# Altium schematic sheet OLED胸牌_从机_2022-05-08.schdoc
size 312 x 139 mm
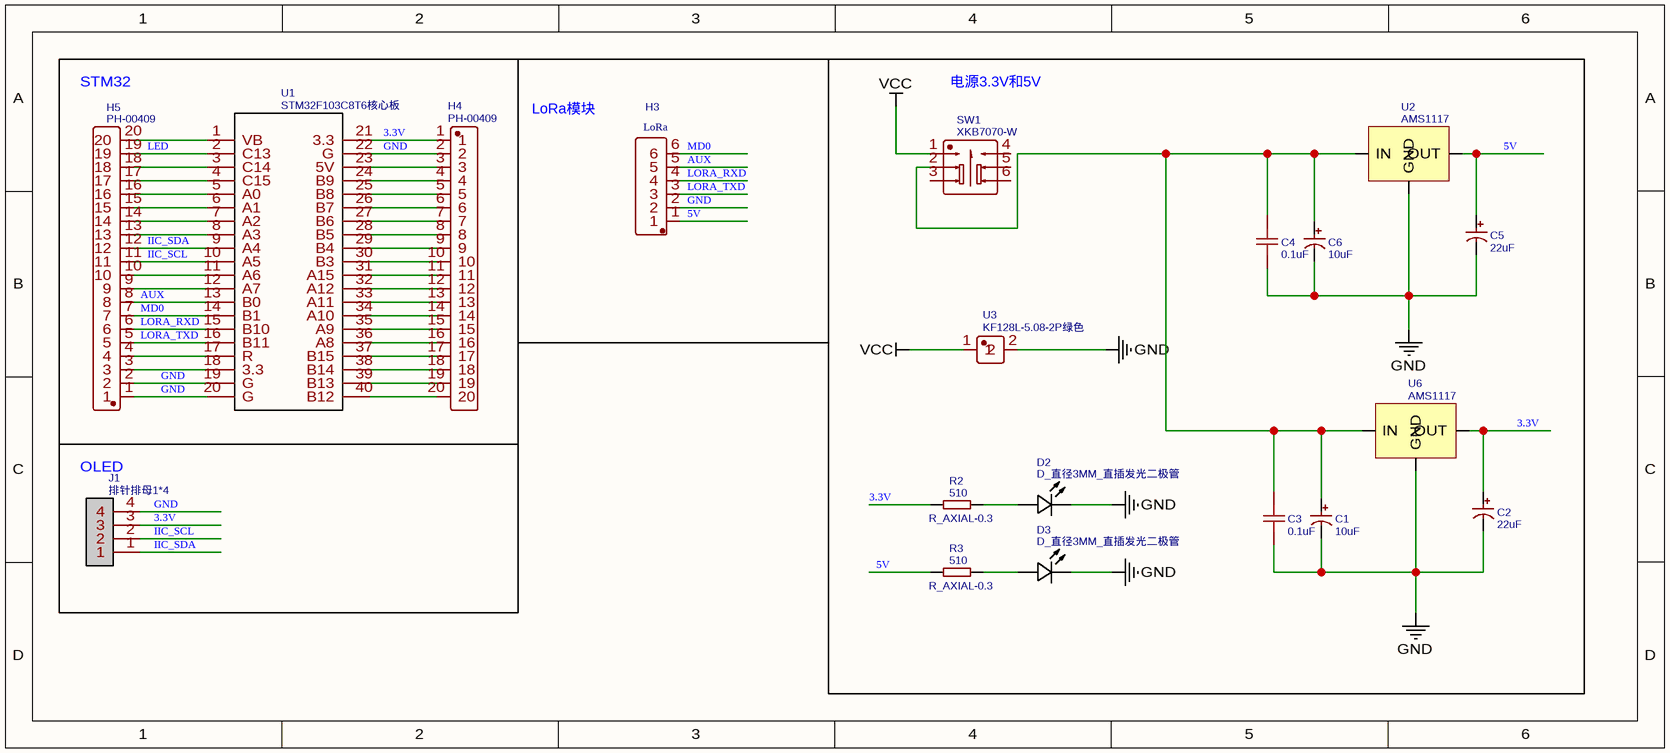
[diagram p0: OLED胸牌_从机_2022-05-08.schdoc]

## Parts
C1  10uF  [电容]
C2  22uF  [电容]
C3  0.1uF  [RAD-0.1]
C4  0.1uF  [RAD-0.1]
C5  22uF  [电容]
C6  10uF  [电容]
D2  D_直径3MM_直插发光二极管  [D_孔距2.25MM（直径3MM）_直插发光二极管_20201203]
D3  D_直径3MM_直插发光二极管  [D_孔距2.25MM（直径3MM）_直插发光二极管_20201203]
H3  LoRa  [HDR-TH_6P-P2.54-V-F]
H4  PH-00409  [HDR-TH_20P-P2.54-V-M]
H5  PH-00409  [HDR-TH_20P-P2.54-V-M]
J1  排针排母1*4  [排针-2.54间距-1*4P]
R2  510  [R_AXIAL-0.3]
R3  510  [R_AXIAL-0.3]
SW1  XKB7070-W  [SW-TH_6P-L7.2-W7.2-P2.00-LS5.0]
U1  STM32F103C8T6核心板  [STM32核心板]
U2  AMS1117  [AMS1117-3.3]
U3  KF128L-5.08-2P绿色  [TH_KF128L-5.08-2P]
U6  AMS1117  [AMS1117-3.3]

## Blocks framed on the sheet
STM32: H4 H5 U1
LoRa模块: H3
电源3.3V和5V: C1-C6 D2 D3 R2 R3 SW1 U2 U3 U6
OLED: J1

## Nets
GND: C1.2 C2.2 C3.1 C4.1 C5.2 C6.2 D2.2(K) D3.2(K) H3.2 H4.2 H5.1 H5.2 J1.4 U1.19(G) U1.20(G) U1.22(G) U2.1(GND) U3.2 U6.1(GND)
VCC: SW1.1 U3.1
3.3V: C2.1 H4.1 J1.3 R2.1 U1.21(3.3) U6.2(OUT)
5V: C5.1 H3.1 R3.1 U2.2(OUT)
AUX: H3.5 H5.8 U1.13(B0)
IIC_SCL: H5.11 J1.2 U1.10(A5)
IIC_SDA: H5.12 J1.1 U1.9(A4)
LED: H5.19 U1.2(C13)
LORA_RXD: H3.4 H5.6 U1.15(B10)
LORA_TXD: H3.3 H5.5 U1.16(B11)
MD0: H3.6 H5.7 U1.14(B1)
NetC1_1: C1.1 C3.2 C4.2 C6.1 SW1.2 U2.3(IN) U6.3(IN)
NetD2_1: D2.1(A) R2.2
NetD3_1: D3.1(A) R3.2
NetH4_3: H4.3 U1.23(5V)
NetH4_4: H4.4 U1.24(B9)
NetH4_5: H4.5 U1.25(B8)
NetH4_6: H4.6 U1.26(B7)
NetH4_7: H4.7 U1.27(B6)
NetH4_8: H4.8 U1.28(B5)
NetH4_9: H4.9 U1.29(B4)
NetH4_10: H4.10 U1.30(B3)
NetH4_11: H4.11 U1.31(A15)
NetH4_12: H4.12 U1.32(A12)
NetH4_13: H4.13 U1.33(A11)
NetH4_14: H4.14 U1.34(A10)
NetH4_15: H4.15 U1.35(A9)
NetH4_16: H4.16 U1.36(A8)
NetH4_17: H4.17 U1.37(B15)
NetH4_18: H4.18 U1.38(B14)
NetH4_19: H4.19 U1.39(B13)
NetH4_20: H4.20 U1.40(B12)
NetH5_3: H5.3 U1.18(3.3)
NetH5_4: H5.4 U1.17(R)
NetH5_9: H5.9 U1.12(A7)
NetH5_10: H5.10 U1.11(A6)
NetH5_13: H5.13 U1.8(A3)
NetH5_14: H5.14 U1.7(A2)
NetH5_15: H5.15 U1.6(A1)
NetH5_16: H5.16 U1.5(A0)
NetH5_17: H5.17 U1.4(C15)
NetH5_18: H5.18 U1.3(C14)
NetH5_20: H5.20 U1.1(VB)

Not connected (* = marked no-connect by the designer): SW1 3 4 5 6

## Notes on the sheet
- (in symbol 510) R_AXIAL-0.3

## Library data of the parts
C1 C6 = 10uF: BOM_Manufacturer: ValuePro; BOM_Manufacturer Part: 10uF 16V 3*5; nameAlias: Capacitance; BOM_Supplier: LCSC; BOM_Supplier Part: C43798; BOM_JLCPCB Part Class: Extended Part; spicePre: C; spiceSymbolName: 10uF 16V 3*5
C2 C5 = 22uF: BOM_Manufacturer: ValuePro; BOM_Manufacturer Part: 22uF 16V 4*5; nameAlias: Capacitance; BOM_Supplier: LCSC; BOM_Supplier Part: C43800; BOM_JLCPCB Part Class: Extended Part; spicePre: C; spiceSymbolName: 22uF 16V 4*5
C3 C4 = 0.1uF: BOM_Manufacturer: WTC; BOM_Manufacturer Part: 0603B104K500; nameAlias: Capacitance; BOM_Supplier: LCSC; BOM_Supplier Part: C90807; BOM_JLCPCB Part Class: Extended Part; spicePre: C; spiceSymbolName: 0603B104K500
D2 D3 = D_直径3MM_直插发光二极管: Contributor: Jonejen; spicePre: D; spiceSymbolName: D_直径3MM_直插发光二极管
H3 = LoRa: BOM_Manufacturer: Ckmtw; BOM_Manufacturer Part: 220S-1*6P H=8.5MM Ytype Gold-plated; Contributor: LCSC; BOM_Supplier: LCSC; BOM_Supplier Part: C124415; BOM_JLCPCB Part Class: Extended Part; spicePre: H; spiceSymbolName: 220S-1*6P H=8.5MM Ytype Gold-plated
H4 H5 = PH-00409: BOM_Manufacturer: Liansheng(连盛); Contributor: LCSC; BOM_Supplier: LCSC; BOM_Supplier Part: C2685159; BOM_Manufacturer Part: PH-00409; spicePre: H; spiceSymbolName: PH-00409
J1 = 排针排母1*4: Contributor: Li...JinHong; spicePre: J; spiceSymbolName: 排针排母1*4
R2 R3 = 510: BOM_Manufacturer: ResistorToday; BOM_Manufacturer Part: ECSF2512FR050K9; nameAlias: Value; Contributor: CYZ139; Package Display: Yes; BOM_Supplier: LCSC; BOM_Supplier Part: C349179; spicePre: R; spiceSymbolName: RES
SW1 = XKB7070-W: BOM_Manufacturer: XKB Enterprise; Contributor: LCSC; BOM_Supplier: LCSC; BOM_Supplier Part: C318864; BOM_Manufacturer Part: XKB7070-W; BOM_JLCPCB Part Class: Extended Part; spicePre: S; spiceSymbolName: XKB7070-W
U1 = STM32F103C8T6核心板: Contributor: yuleiweiheluo; spicePre: U; spiceSymbolName: STM32F103C8T6核心板
U2 U6 = AMS1117: Contributor: zhangxiaobudong; spicePre: U; spiceSymbolName: AMS1117
U3 = KF128L-5.08-2P绿色: BOM_Manufacturer: null; Contributor: LCSC; BOM_Supplier: LCSC; BOM_Supplier Part: C2916952; BOM_Manufacturer Part: KF128L-5.08-2P绿色; BOM_JLCPCB Part Class: Extended Part; spicePre: U; spiceSymbolName: KF128L-5.08-2P绿色